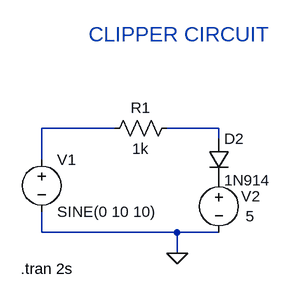
[diagram p0: schematic 6)clipper.asc]
6)clipper.asc, the LTspice schematic file:
Version 4
SHEET 1 1040 680
WIRE 160 112 48 112
WIRE 320 112 240 112
WIRE 320 128 320 112
WIRE 48 160 48 112
WIRE 48 272 48 240
WIRE 256 272 48 272
WIRE 320 272 256 272
WIRE 256 304 256 272
FLAG 256 304 0
SYMBOL voltage 48 144 R0
WINDOW 123 0 0 Left 0
WINDOW 39 0 0 Left 0
SYMATTR InstName V1
SYMATTR Value SINE(0 10 10)
SYMBOL voltage 320 176 R0
WINDOW 0 34 40 Left 2
WINDOW 3 41 71 Left 2
WINDOW 123 0 0 Left 0
WINDOW 39 0 0 Left 0
SYMATTR InstName V2
SYMATTR Value 5
SYMBOL res 256 96 R90
WINDOW 0 0 56 VBottom 2
WINDOW 3 32 56 VTop 2
SYMATTR InstName R1
SYMATTR Value 1k
SYMBOL diode 304 128 R0
SYMATTR InstName D2
SYMATTR Value 1N914
TEXT 16 328 Left 2 !.tran 2s
TEXT 120 -32 Left 3 ;CLIPPER CIRCUIT

The netlist it stands for:
* 6)clipper.asc
V1 N001 0 SINE(0 10 10)
V2 P001 0 5
R1 N002 N001 1k
D2 N002 P001 1N914
.model D D
.lib standard.dio
.tran 2s
* CLIPPER CIRCUIT
.backanno
.end